# EAGLE design i2c_adc_avr_inline_soic_pth (EAGLE 6.4)
DATABASE: /home/mes/eagle/PARTSDB.txt
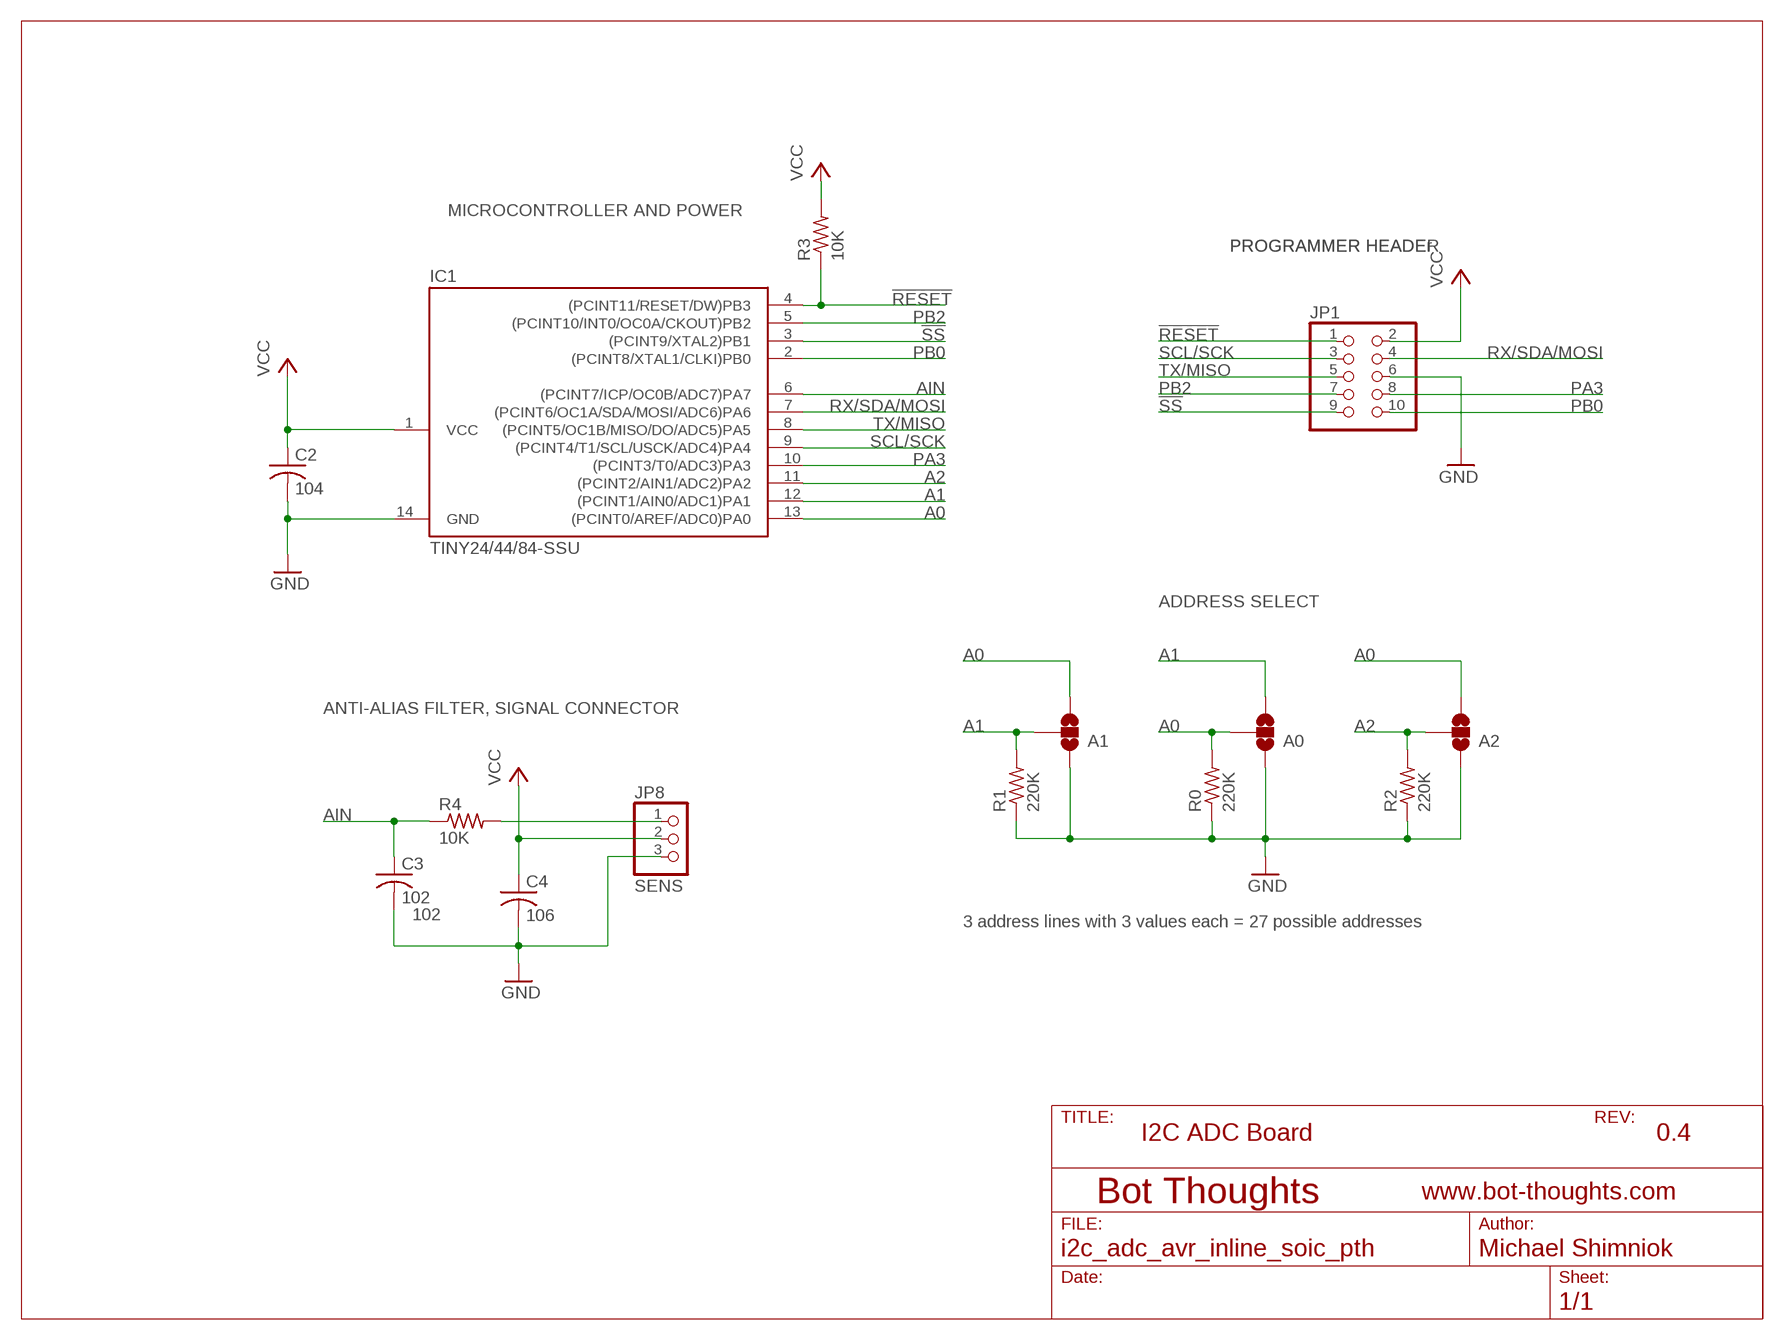
[diagram p0: schematic, sheet 1]

## Parts
A0  SOLDERJUMPER_2WAYS  [SJ_3]
A1  SOLDERJUMPER_2WAYS  [SJ_3]
A2  SOLDERJUMPER_2WAYS  [SJ_3]
C2  104  C-USC0603  [C0603]
C3  102  C-USC0603  [C0603]
C4  106  C-USC0603  [C0603]
IC1  TINY24/44/84-SSU  [SOIC14]
JP1  PINHD-2X05_2.54-90°  [2X05/90]
JP8  SENS  PINHD-1X03_2.54-S  [1X03-S]
R0  220K  R-US_R0603  [R0603]
R1  220K  R-US_R0603  [R0603]
R2  220K  R-US_R0603  [R0603]
R3  10K  R-US_R0603  [R0603]
R4  10K  R-US_R0603  [R0603]

## Nets
!RESET: IC1.4((PCINT11/RESET/DW)PB3) JP1.1 R3.1
!SS: IC1.3((PCINT9/XTAL2)PB1) JP1.9
A0: A0.2 A1.3 A2.3 IC1.13((PCINT0/AREF/ADC0)PA0) R0.2
A1: A0.3 A1.2 IC1.12((PCINT1/AIN0/ADC1)PA1) R1.2
A2: A2.2 IC1.11((PCINT2/AIN1/ADC2)PA2) R2.2
AIN: C3.1 IC1.6((PCINT7/ICP/OC0B/ADC7)PA7) R4.1
GND: A0.1 A1.1 A2.1 C2.2 C3.2 C4.2 IC1.14(GND) JP1.6 JP8.3 R0.1 R1.1 R2.1
N$1: JP8.1 R4.2
PA3: IC1.10((PCINT3/T0/ADC3)PA3) JP1.8
PB0: IC1.2((PCINT8/XTAL1/CLKI)PB0) JP1.10
PB2: IC1.5((PCINT10/INT0/OC0A/CKOUT)PB2) JP1.7
RX/SDA/MOSI: IC1.7((PCINT6/OC1A/SDA/MOSI/ADC6)PA6) JP1.4
SCL/SCK: IC1.9((PCINT4/T1/SCL/USCK/ADC4)PA4) JP1.3
TX/MISO: IC1.8((PCINT5/OC1B/MISO/DO/ADC5)PA5) JP1.5
VCC: C2.1 C4.1 IC1.1(VCC) JP1.2 JP8.2 R3.2

## Notes on the sheet
- MICROCONTROLLER AND POWER
- PROGRAMMER HEADER | PROGRAMMER HEADEr
- ADDRESS SELECT
- ANTI-ALIAS FILTER, SIGNAL CONNECTOR
- 3 address lines with 3 values each = 27 possible addresses
- I2C ADC Board | 0.4

## Library data of the parts
A0 A1 A2 = SparkFun:SOLDERJUMPER_2WAY: Solder Jumper 2 way solder jumper
C2 = rcl:C-US: CAPACITOR, American symbol; PARTNO: C1608X7R1E104K080AA
C3 = rcl:C-US: CAPACITOR, American symbol; CODE: 102; PARTNO: CL10B102KB8SFNC
C4 = rcl:C-US: CAPACITOR, American symbol; PARTNO: CL10A106MP8NNNC
IC1 = avr-7:TINY24/44/84
JP1 = pinhead-2:PINHD-2X05: PIN HEADER
JP8 = pinhead-2:PINHD-1X03: PIN HEADER
R0 R1 R2 = rcl:R-US_: RESISTOR, American symbol; PARTNO: RC1608J224CS
R3 R4 = rcl:R-US_: RESISTOR, American symbol; PARTNO: 1622829-1

## Board
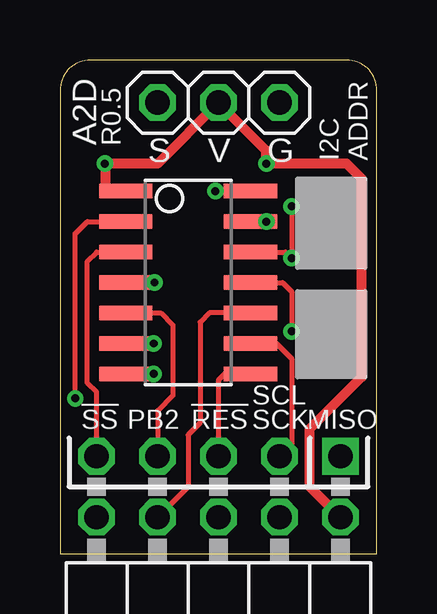
[diagram p1: board, top side]
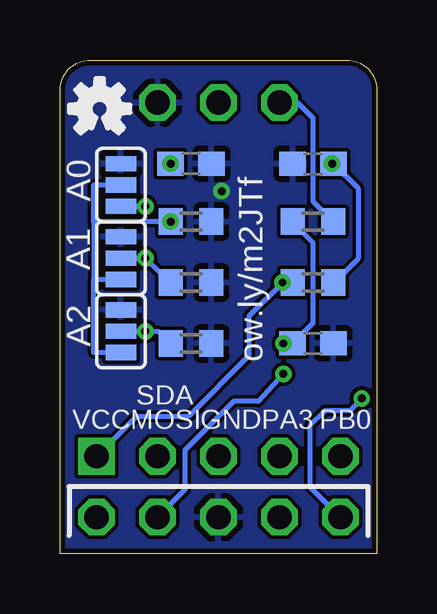
[diagram p2: board, bottom side, seen from below]

Size 13.21 x 20.57 mm. Coordinates in mm from the lower left corner, seen from the top.
Outline: 13.21,0 13.21,19.3 arc90 11.94,20.57 1.27,20.57 arc90 0,19.3 0,0 13.21,0
Copper layers (1*16): Top 0.0356mm / dielectric 1.5011mm / Bottom 0.0356mm
Design rules "default *": minimum track width 6mil, minimum drill 13mil, track to track 6mil, track to pad 6mil, pad to pad 6mil, via to via 6mil, smd to smd 6mil, copper to edge 8mil, drill to drill 6mil, minimum pad ring 7mil, minimum via ring 7mil, stop-mask expansion 4mil, vias tented up to drill 20mil, thermal gap 10mil

### Footprints (pad centres in the part's own frame; a part is rotated, then mirrored left to right if it is on the bottom)
SJ_3 = smd 0.635 x 1.27: 1 -0.889,0; 2 0,0; 3 0.889,0
C0603 = smd 1.1 x 1: 1 -0.85,0; 2 0.85,0
SOIC14 = smd 0.61 x 2.21: 1 -3.81,-2.603; 2 -2.54,-2.603; 3 -1.27,-2.603; 4 0,-2.603; 5 1.27,-2.603; 6 2.54,-2.603; 7 3.81,-2.603; 8 3.81,2.603; 9 2.54,2.603; 10 1.27,2.603; 11 0,2.603; 12 -1.27,2.603; 13 -2.54,2.603; 14 -3.81,2.603
2X05/90 = drill 1.016 square: 1 -5.08,-6.35 | drill 1.016 octagon: 2 -5.08,-3.81; 3 -2.54,-6.35; 4 -2.54,-3.81; 5 0,-6.35; 6 0,-3.81; 7 2.54,-6.35; 8 2.54,-3.81; 9 5.08,-6.35; 10 5.08,-3.81
1X03-S = drill 1.016 octagon: 1 -2.54,0; 2 0,0; 3 2.54,0
R0603 = smd 1 x 1.1: 1 -0.85,0; 2 0.85,0

### Placement (x,y rotation side)
A0  10.67,15.37 270 bottom
A1  10.67,12.32 270 bottom
A2  10.67,9.27 270 bottom
C2  2.67,16.26 180 bottom
C3  2.67,8.76 0 bottom
C4  7.75,16.26 0 bottom
IC1  5.33,11.3 270 top
JP1  6.6,-2.29 180 top
JP8  6.6,18.8 0 top
R0  7.75,13.84 180 bottom
R1  7.75,11.3 180 bottom
R2  7.75,8.76 180 bottom
R3  2.67,11.3 0 bottom
R4  2.67,13.84 0 bottom

### Tracks (layer width: path | path; a pad name or v marks a point on that pad's centre or on a via)
!RESET  (via drill 0.33)
  Top 0.203: v3.94,11.3 IC1.4
  Bottom 0.203: R3.1 v3.94,11.3 5.33,9.91 5.33,8.26 7.87,5.71 10.03,5.71 JP1.1
!SS
  Top 0.203: JP1.9 1.52,6.73 1.14,7.11
  Top 0.217: 1.14,7.11 1.14,12.19 1.52,12.57 IC1.3
A0  (via drill 0.33)
  Top 0.203: IC1.13 R0.2
  Bottom 0.203: 11.81,13.84 11.81,15.37 A0.2 | 11.81,13.84 11.81,11.43 | 11.81,11.43 A1.3 | A2.3 11.81,8.38 11.81,11.43 | R0.2 11.81,13.84
  other vias: 8.6,13.84
A1  (via drill 0.33)
  Top 0.203: IC1.12 9.4,12.57 v9.65,12.32 v9.65,14.48
  Bottom 0.203: 8.64,11.43 8.6,11.39 R1.2 v9.65,12.32 A1.2 | A0.3 v9.65,14.48
A2  (via drill 0.33)
  Top 0.203: IC1.11 9.27,11.3 9.65,10.92 v9.65,9.27
  Bottom 0.203: A2.2 v9.65,9.27 9.11,9.27 R2.2
AIN  (via drill 0.33)
  Top 0.203: IC1.6 v3.9,8.76
  Bottom 0.203: v3.9,8.76 C3.1 2.67,9.61 2.67,12.95 3.52,13.8 R4.1
GND  (via drill 0.33)
  Top 0.203: 7.37,15.11 v6.48,15.11
  Top 0.406: IC1.14 7.37,15.11
  pour Bottom: 0,0 0,19.3 arc-90 1.27,20.57 11.94,20.57 arc-90 13.21,19.3 13.21,0
N$1
  Bottom 0.203: JP8.1 3.3,18.8 2.67,18.16 2.67,14.69 R4.2
PA3
  Top 0.203: IC1.10 6.22,10.03 5.84,9.65 5.84,5.46 5.33,4.95 5.33,2.79 JP1.8
PB0  (via drill 0.33)
  Top 0.203: v0.64,6.48 0.64,13.34 1.14,13.84 IC1.2
  Bottom 0.203: v0.64,6.48 1.14,5.97 2.16,5.97 2.79,5.33 2.79,2.79 JP1.10
PB2
  Top 0.203: IC1.5 4.19,10.03 4.7,9.53 4.7,6.6 4.06,5.97 JP1.7
RX/SDA/MOSI  (via drill 0.33)
  Top 0.203: IC1.7 v3.9,7.49
  Bottom 0.203: v3.9,7.49 4.95,6.35 5.97,6.35 8,4.32 8,2.67 JP1.4
SCL/SCK
  Top 0.203: IC1.9 9.02,8.76 9.65,8.13 9.65,4.57 JP1.3
TX/MISO
  Top 0.203: IC1.8 6.86,7.49 6.6,7.24 JP1.5
VCC  (via drill 0.33)
  Top 0.203: IC1.1 2.37,15.11
  Top 0.406: 2.37,15.11 1.91,15.11 1.91,16.26 v1.87,16.26 4.06,16.26 JP8.2 8.6,16.8 C4.1 11.94,16.26 12.57,15.62 12.57,7.37 10.41,5.21 10.41,2.79 JP1.2
  Bottom 0.203: v1.87,16.26 C2.1 0.76,15.2 0.76,12.32 1.78,11.3 R3.2
  other vias: 8.6,16.26

### Text on the board
tPlace: R0.5 | I2C / ADDR
bPlace: ow.ly/m2JTf
tNames: A2D | S | V | G | SCL | !SS | PB2 | !RES | SCK | MISO
bNames: SDA | PB0 | PA3 | GND | MOSI | VCC
tsilk: S | G | V | A2D | R0.5 | I2C / ADDR | SCL | !SS | PB2 | !RES | SCK | MISO
bsilk: 104 | 106 | 10K | 220K | A0 | 10K | 220K | A1 | 102 | 220K | A2 | ow.ly/m2JTf | SDA | PB0 | PA3 | GND | MOSI | VCC